# Altium schematic sheet RS485_PART.SchDoc
size A
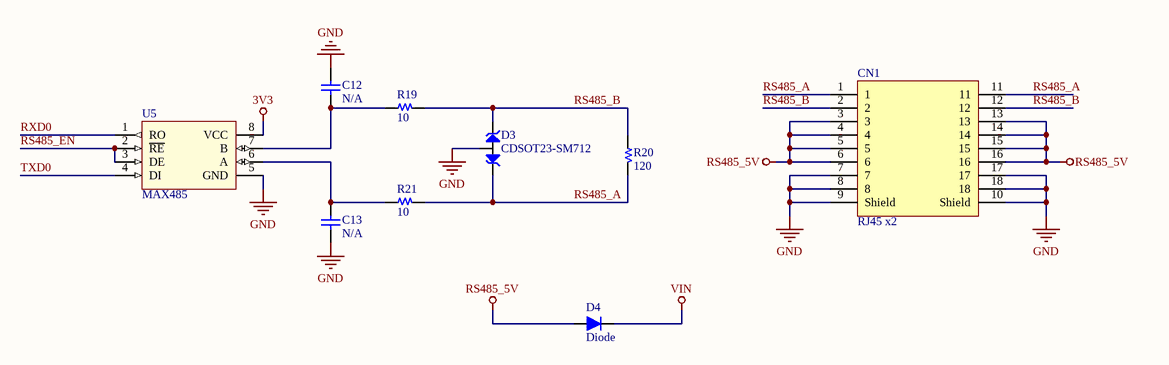
[diagram p0: RS485_PART.SchDoc]

## Parts
C12  N/A  [C 1206]
C13  N/A  [C 1206]
CN1  RJ45 x2  [CONN/RJ45/x2]
D3  CDSOT23-SM712  [SOT-23]
D4  Diode  [SOD123]
R19  10  [R 0603]
R20  120  [R 0603]
R21  10  [R 0603]
U5  MAX485  [SOIC-8]

## Nets
3V3: U5.8(VCC)
GND: C12.1 C13.2 CN1.7 CN1.8 CN1.9(Shield) CN1.10(Shield) CN1.17 CN1.18 D3.3(COM) U5.5(GND)
RS485_5V: CN1.3 CN1.4 CN1.5 CN1.6 CN1.13 CN1.14 CN1.15 CN1.16 D4.1(A)
VIN: D4.2(K)
RS485_A: CN1.1 CN1.11 D3.1(IO1) R20.2 R21.2
RS485_B: CN1.2 CN1.12 D3.2(IO2) R19.2 R20.1
RS485_EN: U5.2(~{RE}) U5.3(DE)
RXD0: U5.1(RO)
TXD0: U5.4(DI)
NetC12_2: C12.2 R19.1 U5.7(B)
NetC13_1: C13.1 R21.1 U5.6(A)

## Library data of the parts
C12 C13 = Capacitor NP: Capacitor non-pol
CN1 = CON RJ45 x2: Connector RJ45 X2
D3 = CDSOT23-SM712: TVS DIODE 7V/12V 14V/26V SOT23-3
D4 = Diode: Default Diode
R19-R21 = Resistor
U5 = MAX485: Low-Power, Slew-Rate-Limited  RS-485/RS-422 Transceivers